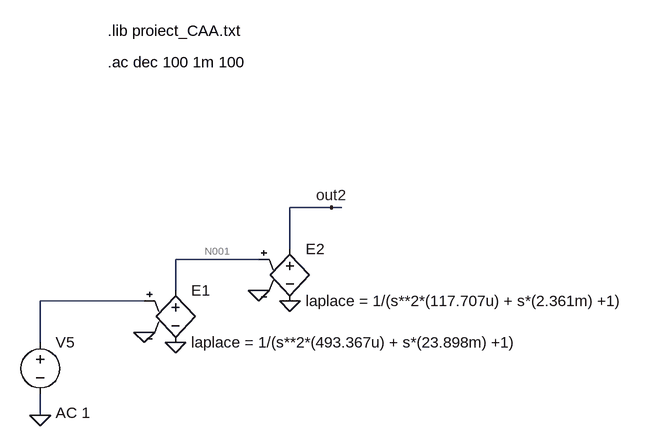
[diagram p0: schematic test_biquad_laplace.asc]
test_biquad_laplace.asc, the LTspice schematic file:
Version 4
SHEET 1 2136 1620
WIRE 752 800 688 800
WIRE 768 800 752 800
WIRE 688 864 688 800
WIRE 640 880 512 880
WIRE 512 928 512 880
WIRE 464 944 304 944
WIRE 304 1008 304 944
WIRE 304 1120 304 1088
FLAG 464 992 0
FLAG 512 1008 0
FLAG 640 928 0
FLAG 688 944 0
FLAG 304 1120 0
FLAG 752 800 out2
SYMBOL e 512 912 R0
SYMATTR InstName E1
SYMATTR Value laplace = 1/(s**2*(493.367u) + s*(23.898m) +1)
SYMBOL e 688 848 R0
SYMATTR InstName E2
SYMATTR Value laplace = 1/(s**2*(117.707u) + s*(2.361m) +1)
SYMBOL voltage 304 992 R0
WINDOW 123 24 124 Left 2
WINDOW 39 0 0 Left 0
WINDOW 3 24 44 Left 2
SYMATTR Value2 AC 1
SYMATTR Value ""
SYMATTR InstName V5
TEXT 408 528 Left 2 !.lib proiect_CAA.txt
TEXT 408 576 Left 2 !.ac dec 100 1m 100

The netlist it stands for:
* test_biquad_laplace.asc
E1 N001 0 N002 0 laplace = 1/(s**2*(493.367u) + s*(23.898m) +1)
E2 out2 0 N001 0 laplace = 1/(s**2*(117.707u) + s*(2.361m) +1)
V5 N002 0 AC 1
.lib proiect_CAA.txt
.ac dec 100 1m 100
.backanno
.end

* Results of the author's LTspice run, read from the files saved beside the schematic
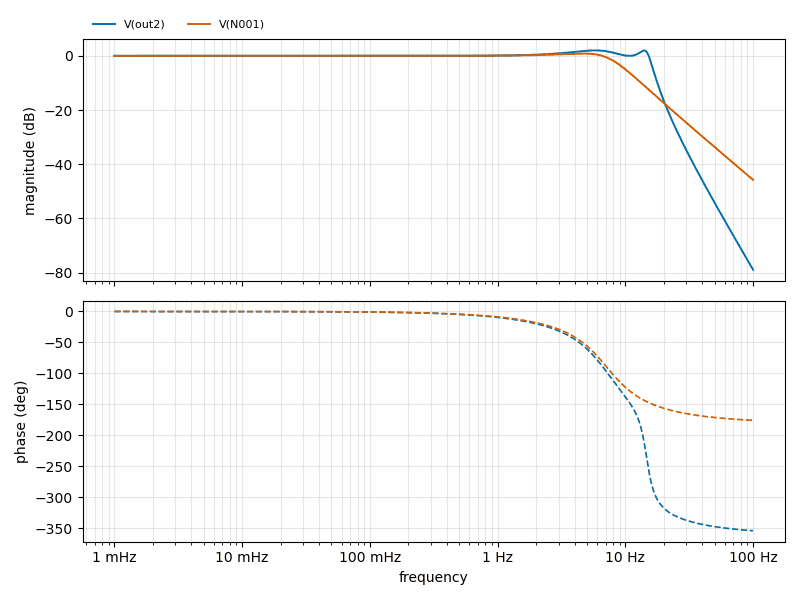
[diagram p1: AC Analysis of test_biquad_laplace.asc, plotted from the saved traces]
* AC Analysis, 1 run:
*   V(out2): 0.00 dB at 1 mHz, -78.93 dB at 100 Hz, peak 2.00 dB at 5.888 Hz, 3 dB below the peak at 15.5 Hz
*   V(N001): 0.00 dB at 1 mHz, -45.77 dB at 100 Hz, peak 0.85 dB at 4.677 Hz, 3 dB below the peak at 8.257 Hz